# EAGLE design ArduinoInterface_v4.1 (EAGLE 9.2.1)
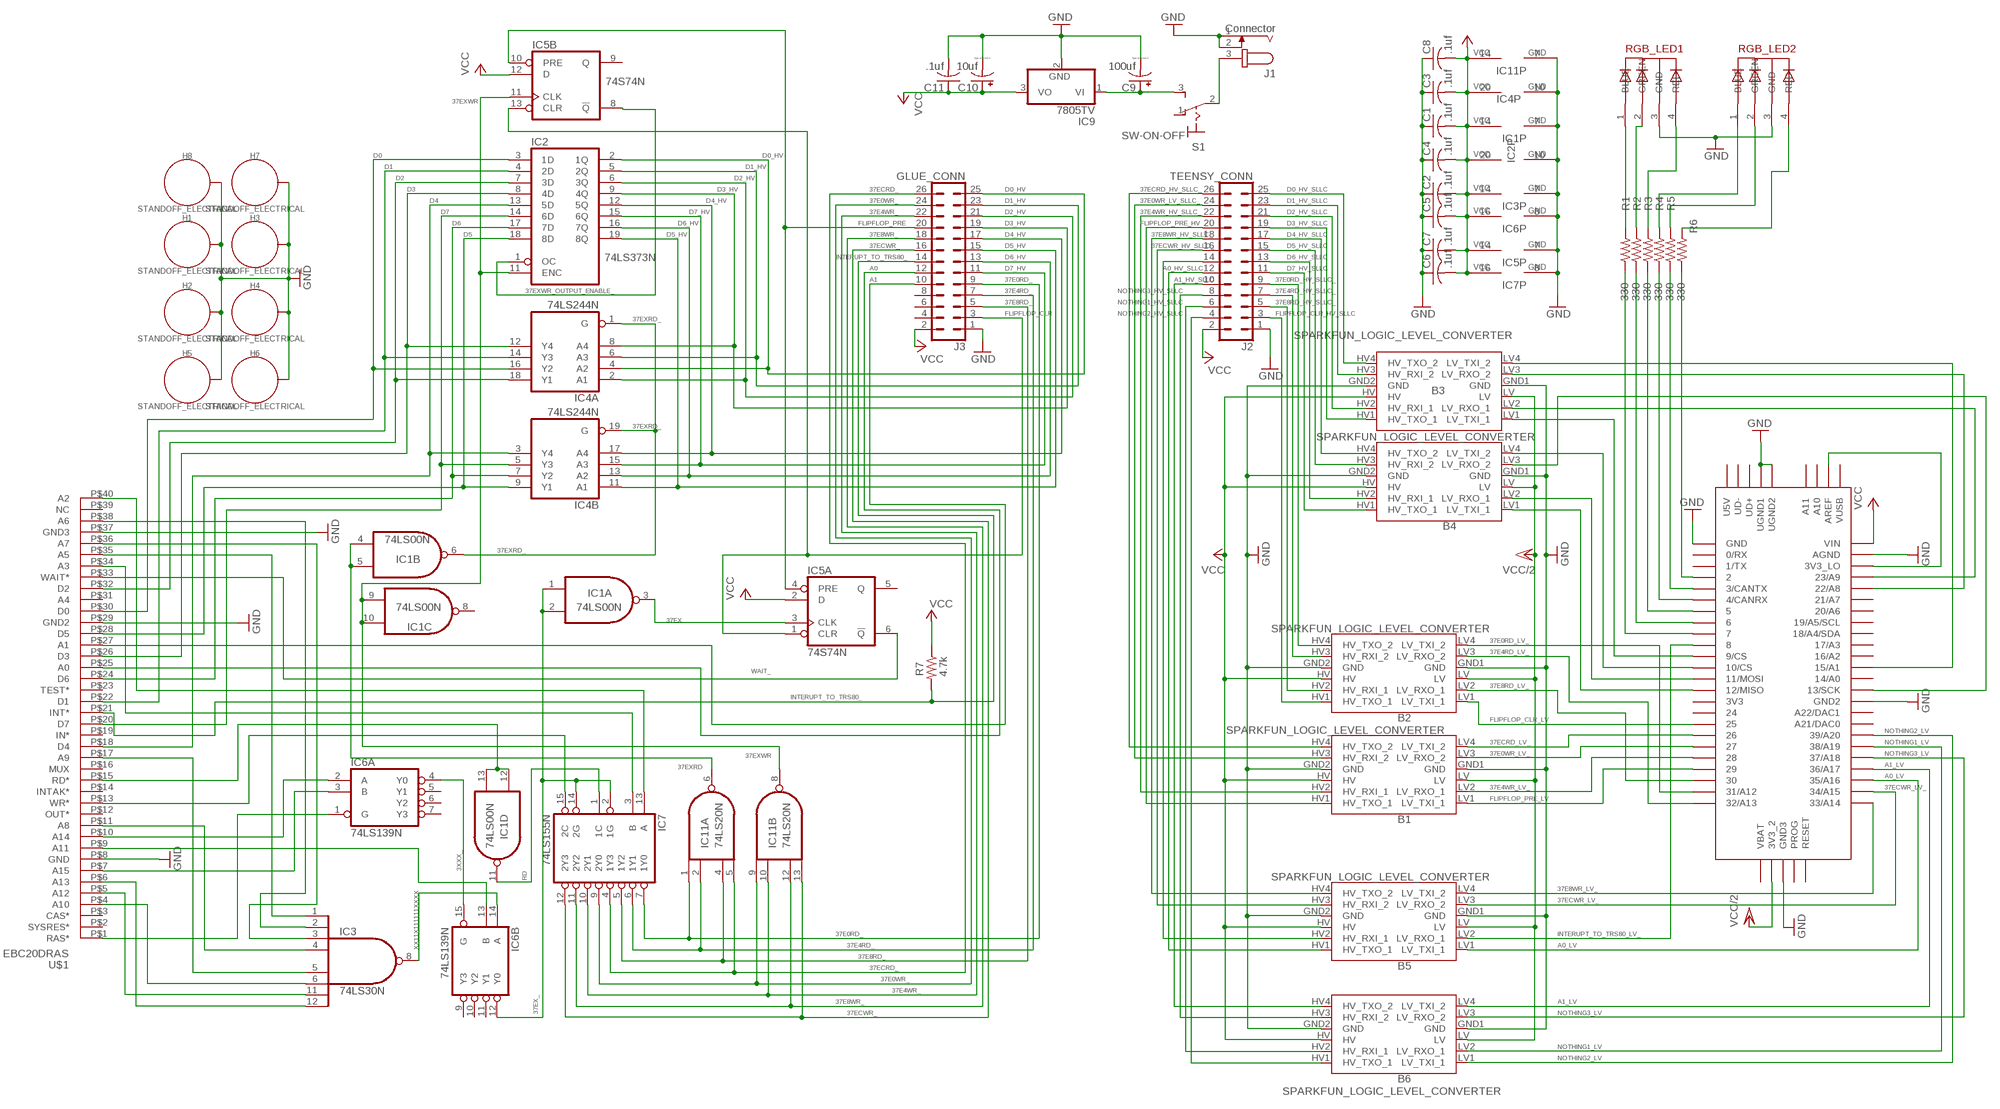
[diagram p0: schematic, sheet 1]

## Parts
B1  SPARKFUN_LOGIC_LEVEL_CONVERTER  [SPARKFUN_LOGIC_LEVEL_CONVERTER]
B2  SPARKFUN_LOGIC_LEVEL_CONVERTER  [SPARKFUN_LOGIC_LEVEL_CONVERTER]
B3  SPARKFUN_LOGIC_LEVEL_CONVERTER  [SPARKFUN_LOGIC_LEVEL_CONVERTER]
B4  SPARKFUN_LOGIC_LEVEL_CONVERTER  [SPARKFUN_LOGIC_LEVEL_CONVERTER]
B5  SPARKFUN_LOGIC_LEVEL_CONVERTER  [SPARKFUN_LOGIC_LEVEL_CONVERTER]
B6  SPARKFUN_LOGIC_LEVEL_CONVERTER  [SPARKFUN_LOGIC_LEVEL_CONVERTER]
C1  .1uf  C-US025-025X050  [C025-025X050]
C2  .1uf  C-US025-025X050  [C025-025X050]
C3  .1uf  C-US025-025X050  [C025-025X050]
C4  .1uf  C-US025-025X050  [C025-025X050]
C5  .1uf  C-US025-025X050  [C025-025X050]
C6  .1uf  C-US025-025X050  [C025-025X050]
C7  .1uf  C-US025-025X050  [C025-025X050]
C8  .1uf  C-US025-025X050  [C025-025X050]
C9  100uf  CPOL-USE5-6  [E5-6]
C10  10uf  CPOL-USE5-6  [E5-6]
C11  .1uf  C-US025-025X050  [C025-025X050]
H1  STANDOFF_ELECTRICAL  [STANDOFF-ELECTRICAL]
H2  STANDOFF_ELECTRICAL  [STANDOFF-ELECTRICAL]
H3  STANDOFF_ELECTRICAL  [STANDOFF-ELECTRICAL]
H4  STANDOFF_ELECTRICAL  [STANDOFF-ELECTRICAL]
H5  STANDOFF_ELECTRICAL  [STANDOFF-ELECTRICAL]
H6  STANDOFF_ELECTRICAL  [STANDOFF-ELECTRICAL]
H7  STANDOFF_ELECTRICAL  [STANDOFF-ELECTRICAL]
H8  STANDOFF_ELECTRICAL  [STANDOFF-ELECTRICAL]
IC1  74LS00N  [DIL14]
IC2  74LS373N  [DIL20]
IC3  74LS30N  [DIL14]
IC4  74LS244N  [DIL20]
IC5  74S74N  [DIL14]
IC6  74LS139N  [DIL16]
IC7  74LS155N  [DIL16]
IC9  7805TV  [TO220V]
IC11  74LS20N  [DIL14]
J1  Connector  JACK-PLUG0  [SPC4077]
J2  TEENSY_CONN  CONN_13X22X13  [2X13]
J3  GLUE_CONN  CONN_13X22X13  [2X13]
R1  330  R-US_0204/2V  [0204V]
R2  330  R-US_0204/2V  [0204V]
R3  330  R-US_0204/2V  [0204V]
R4  330  R-US_0204/2V  [0204V]
R5  330  R-US_0204/2V  [0204V]
R6  330  R-US_0204/2V  [0204V]
R7  4.7k  R-US_0204/2V  [0204V]
RGB_LED1  5MMRGBLED  [LED5MMRGB]
RGB_LED2  5MMRGBLED  [LED5MMRGB]
S1  SW-ON-OFF  M9040P  [M9040P]
U$1  EBC20DRAS  [EBC20DRAS]
U$2  TEENSY_3.5/3.6  [TEENSY_3.5/3.6]

## Nets
3XXX_: IC6.4(A:Y0) IC6.15(B:G)
9V: C9.+ IC9.1(VI) S1.3(S)
9V_TO_SW: J1.3 S1.2(P)
37E0RD_: IC7.7(1Y0) IC11.1(A:I0) J3.9
37E0RD_HV_SLLC_: B2.HV4(HV_TXO_2) J2.9
37E0RD_LV_: B2.LV4(LV_TXI_2) U$2.31/A12
37E0WR_: IC7.9(2Y0) IC11.9(B:I0) J3.24
37E0WR_LV_: B1.LV3(LV_RXO_2) U$2.27
37E0WR_LV_SLLC_: B1.HV3(HV_RXI_2) J2.24
37E4RD_: IC7.6(1Y1) IC11.2(A:I1) J3.7
37E4RD_HV_SLLC_: B2.HV3(HV_RXI_2) J2.7
37E4RD_LV_: B2.LV3(LV_RXO_2) U$2.32/A13
37E4WR_: IC7.10(2Y1) IC11.10(B:I1) J3.22
37E4WR_HV_SLLC_: B1.HV2(HV_RXI_1) J2.22
37E4WR_LV_: B1.LV2(LV_RXO_1) U$2.28
37E8RD_: IC7.5(1Y2) IC11.4(A:I2) J3.5
37E8RD_HV_SLLC_: B2.HV2(HV_RXI_1) J2.5
37E8RD_LV_: B2.LV2(LV_RXO_1) U$2.30
37E8WR_: IC7.11(2Y2) IC11.12(B:I2) J3.18
37E8WR_HV_SLLC_: B5.HV4(HV_TXO_2) J2.18
37E8WR_LV_: B5.LV4(LV_TXI_2) U$2.33/A14
37ECRD_: IC7.4(1Y3) IC11.5(A:I3) J3.26
37ECRD_HV_SLLC_: B1.HV4(HV_TXO_2) J2.26
37ECRD_LV_: B1.LV4(LV_TXI_2) U$2.26
37ECWR_: IC7.12(2Y3) IC11.13(B:I3) J3.16
37ECWR_HV_SLLC_: B5.HV3(HV_RXI_2) J2.16
37ECWR_LV_: B5.LV3(LV_RXO_2) U$2.34/A15
37EX: IC1.3(A:O) IC5.3(A:CLK)
37EX_: IC1.1(A:I0) IC1.2(A:I1) IC6.12(B:Y0) IC7.2(1G) IC7.14(2G)
37EXRD: IC1.4(B:I0) IC1.5(B:I1) IC11.6(A:O)
37EXRD_: IC1.6(B:O) IC4.1(A:G) IC4.19(B:G)
37EXWR: IC1.9(C:I0) IC1.10(C:I1) IC2.11(ENC) IC5.11(B:CLK) IC11.8(B:O)
37EXWR_OUTPUT_ENABLE_: IC2.1(OC) IC5.8(B:!Q)
A0: J3.12 U$1.P$25(A0)
A0_HV_SLLC: B5.HV1(HV_TXO_1) J2.12
A0_LV: B5.LV1(LV_TXI_1) U$2.35/A16
A1: J3.10 U$1.P$27(A1)
A1_HV_SLLC: B6.HV4(HV_TXO_2) J2.10
A1_LV: B6.LV4(LV_TXI_2) U$2.36/A17
A2: IC7.13(A) U$1.P$40(A2)
A3: IC7.3(B) U$1.P$34(A3)
A5: IC3.1(I0) U$1.P$35(A5)
A6: IC3.2(I1) U$1.P$38(A6)
A7: IC3.3(I2) U$1.P$36(A7)
A8: IC3.4(I3) U$1.P$11(A8)
A9: IC3.5(I4) U$1.P$17(A9)
A10: IC3.6(I5) U$1.P$4(A10)
A11: IC6.13(B:B) U$1.P$9(A11)
A12: IC3.11(I6) U$1.P$5(A12)
A13: IC3.12(I7) U$1.P$6(A13)
A14: IC6.2(A:A) U$1.P$10(A14)
A15: IC6.3(A:B) U$1.P$7(A15)
D0: IC2.3(1D) IC4.16(A:Y2) U$1.P$30(D0)
D0_HV: IC2.2(1Q) IC4.4(A:A2) J3.25
D0_HV_SLLC: B3.HV4(HV_TXO_2) J2.25
D0_LV: B3.LV4(LV_TXI_2) U$2.15/A1
D1: IC2.4(2D) IC4.14(A:Y3) U$1.P$22(D1)
D1_HV: IC2.5(2Q) IC4.6(A:A3) J3.23
D1_HV_SLLC: B3.HV3(HV_RXI_2) J2.23
D1_LV: B3.LV3(LV_RXO_2) U$2.22/A8
D2: IC2.7(3D) IC4.18(A:Y1) U$1.P$32(D2)
D2_HV: IC2.6(3Q) IC4.2(A:A1) J3.21
D2_HV_SLLC: B3.HV2(HV_RXI_1) J2.21
D2_LV: B3.LV2(LV_RXO_1) U$2.23/A9
D3: IC2.8(4D) IC4.12(A:Y4) U$1.P$26(D3)
D3_HV: IC2.9(4Q) IC4.8(A:A4) J3.19
D3_HV_SLLC: B3.HV1(HV_TXO_1) J2.19
D3_LV: B3.LV1(LV_TXI_1) U$2.9/CS
D4: IC2.13(5D) IC4.3(B:Y4) U$1.P$18(D4)
D4_HV: IC2.12(5Q) IC4.17(B:A4) J3.17
D4_HV_SLLC: B4.HV4(HV_TXO_2) J2.17
D4_LV: B4.LV4(LV_TXI_2) U$2.10/CS
D5: IC2.18(8D) IC4.9(B:Y1) U$1.P$28(D5)
D5_HV: IC2.19(8Q) IC4.11(B:A1) J3.15
D5_HV_SLLC: B4.HV3(HV_RXI_2) J2.15
D5_LV: B4.LV3(LV_RXO_2) U$2.13/SCK
D6: IC2.17(7D) IC4.7(B:Y2) U$1.P$24(D6)
D6_HV: IC2.16(7Q) IC4.13(B:A2) J3.13
D6_HV_SLLC: B4.HV2(HV_RXI_1) J2.13
D6_LV: B4.LV2(LV_RXO_1) U$2.11/MOSI
D7: IC2.14(6D) IC4.5(B:Y3) U$1.P$20(D7)
D7_HV: IC2.15(6Q) IC4.15(B:A3) J3.11
D7_HV_SLLC: B4.HV1(HV_TXO_1) J2.11
D7_LV: B4.LV1(LV_TXI_1) U$2.12/MISO
FLIPFLOP_CLR: IC5.1(A:CLR) IC5.13(B:CLR) J3.3
FLIPFLOP_CLR_HV_SLLC: B2.HV1(HV_TXO_1) J2.3
FLIPFLOP_CLR_LV: B2.LV1(LV_TXI_1) U$2.25
FLIPFLOP_PRE: IC5.4(A:PRE) IC5.10(B:PRE) J3.20
FLIPFLOP_PRE_HV: B1.HV1(HV_TXO_1) J2.20
FLIPFLOP_PRE_LV: B1.LV1(LV_TXI_1) U$2.29
GND: B1.GND1(GND) B1.GND2(GND) B2.GND1(GND) B2.GND2(GND) B3.GND1(GND) B3.GND2(GND) B4.GND1(GND) B4.GND2(GND) B5.GND1(GND) B5.GND2(GND) B6.GND1(GND) B6.GND2(GND) C1.1 C2.1 C3.1 C4.1 C5.1 C6.1 C7.1 C8.1 C9.- C10.- C11.2 H1.P1 H2.P1 H3.P1 H4.P1 H5.P1 H6.P1 H7.P1 H8.P1 IC1.7(P:GND) IC2.10(GND) IC3.7(GND) IC4.10(P:GND) IC5.7(P:GND) IC6.8(P:GND) IC7.8(GND) IC9.2(GND) IC11.7(P:GND) J1.1 J1.2 J2.1 J3.1 RGB_LED1.3(GND) RGB_LED2.3(GND) U$1.P$8(GND) U$1.P$29(GND2) U$1.P$37(GND3) U$2.AGND U$2.GND U$2.GND2 U$2.GND3 U$2.UGND1 U$2.UGND2
INTERUPT_TO_TRS80_: J3.14 R7.2 U$1.P$21(INT*)
INTERUPT_TO_TRS80_HV_SLLC_: B5.HV2(HV_RXI_1) J2.14
INTERUPT_TO_TRS80_LV_: B5.LV2(LV_RXO_1) U$2.8
N$1: U$2.3V3_LO U$2.AREF
N$2: R2.2 RGB_LED1.2(GREEN)
N$3: R6.1 U$2.2
N$4: R5.1 U$2.3/CANTX
N$5: R4.1 U$2.4/CANRX
N$6: R3.1 U$2.5
N$7: R2.1 U$2.6
N$8: R1.1 U$2.7
N$10: R1.2 RGB_LED1.1(BLUE)
N$15: R3.2 RGB_LED1.4(RED)
N$19: R4.2 RGB_LED2.1(BLUE)
N$20: R5.2 RGB_LED2.2(GREEN)
N$21: R6.2 RGB_LED2.4(RED)
NOTHING1_HV_SLLC: B6.HV2(HV_RXI_1) J2.6
NOTHING1_LV: B6.LV2(LV_RXO_1) U$2.38/A19
NOTHING2_HV_SLLC: B6.HV1(HV_TXO_1) J2.4
NOTHING2_LV: B6.LV1(LV_TXI_1) U$2.39/A20
NOTHING3_HV_SLLC: B6.HV3(HV_RXI_2) J2.8
NOTHING3_LV: B6.LV3(LV_RXO_2) U$2.37/A18
RAS_: IC6.1(A:G) U$1.P$1(RAS*)
RD: IC1.11(D:O) IC7.1(1C)
RD_: IC1.12(D:I0) IC1.13(D:I1) U$1.P$15(RD*)
VCC: B1.HV B2.HV B3.HV B4.HV B5.HV B6.HV C1.2 C2.2 C3.2 C4.2 C5.2 C6.2 C7.2 C8.2 C10.+ C11.1 IC1.14(P:VCC) IC2.20(VCC) IC3.14(VCC) IC4.20(P:VCC) IC5.2(A:D) IC5.12(B:D) IC5.14(P:VCC) IC6.16(P:VCC) IC7.16(VCC) IC9.3(VO) IC11.14(P:VCC) J2.2 J3.2 R7.1 U$2.VIN
VCC/2: B1.LV B2.LV B3.LV B4.LV B5.LV B6.LV U$2.3V3_2
WAIT_: IC5.6(A:!Q) U$1.P$33(WAIT*)
WR_: IC7.15(2C) U$1.P$13(WR*)
XX11X111111XXXX: IC3.8(O) IC6.14(B:A)
Unconnected: IC1.8(C:O) IC5.5(A:Q) IC5.9(B:Q) IC6.5(A:Y1) IC6.6(A:Y2) IC6.7(A:Y3) IC6.9(B:Y3) IC6.10(B:Y2) IC6.11(B:Y1) J3.4 J3.6 J3.8 S1.1(O) U$1.P$2(SYSRES*) U$1.P$3(CAS*) U$1.P$12(OUT*) U$1.P$14(INTAK*) U$1.P$16(MUX) U$1.P$19(IN*) U$1.P$23(TEST*) U$1.P$31(A4) U$1.P$39(NC) U$2.0/RX U$2.1/TX U$2.3V3 U$2.14/A0 U$2.16/A2 U$2.17/A3 U$2.18/A4/SDA U$2.19/A5/SCL U$2.20/A6 U$2.21/A7 U$2.21/DAC0(A21/DAC0) U$2.24 U$2.A10 U$2.A11 U$2.A22/DAC1 U$2.PROG U$2.RESET U$2.U5V U$2.UD+ U$2.UD- U$2.VBAT U$2.VUSB

## Library data of the parts
B1-B6 = SparkFun-Boards:SPARKFUN_LOGIC_LEVEL_CONVERTER: SparkFun Logic Level Converter -Bi-Directional This is the mechnical outline for the 3.3V - 5V bi directional logic level converter. *Note, the "LOCK" Package has the header pins staggered by an offset of 5 mils (off center line), so that when you slide a row of standard 0.1" headers into the PTH pads, it will hold position vertically. See the follwing turorial for more information on this type of special footprints: Sneaky Footprints <https://www.sparkfun.com/tutorials/114> SparkFun Products: SparkFun Logic Level Converter - Bi-Directional <https://www.sparkfun.com/products/12009>
C1-C8 C11 = adafruit:C-US: CAPACITOR, American symbol
C9 C10 = resistor:CPOL-US: POLARIZED CAPACITOR, American symbol
H1-H8 = SparkFun-Hardware:STANDOFF_ELECTRICAL: Stand Off Drill holes with an electrical connection. For example, use these to ground your board to a chassis. Example SparkFun Products Screw - Phillips Head (1/4", 4-40, 10 pack) <https://www.sparkfun.com/products/10453> (PRT-10453) Screw - Phillips Head (1/2", 4-40, 10 pack) <https://www.sparkfun.com/products/10452> (PRT-10452) Screw - Phillips Head (3/4", 4-40, 10 pack) <https://www.sparkfun.com/products/10451> (PRT-10451) Screw - Phillips Head (1", 4-40, 10 pack) <https://www.sparkfun.com/products/10450> (PRT-10450)
IC1 = 74xx-us:74*00: Quad 2-input NAND gate
IC2 = 74xx-us:74*373: Octal D type transparent LATCH, edge triggered
IC3 = 74xx-us:74*30: 8-input NAND gate
IC4 = 74xx-us:74*244: Octal BUFFER and LINE DRIVER, 3-state
IC5 = 74xx-us:74*74: Dual D type positive edge triggered FLIP FLOP, preset and clear
IC6 = 74xx-us:74*139: Dual 2-line to 4-line DECODER/DEMULTIPLEXER
IC7 = 74xx-us:74*155: Dual 2-line to 4-line data DECODER/DEMULTIPLEXER
IC9 = linear:78*: Positive VOLTAGE REGULATOR Source: http://cache.national.com/ds/LM/LM78L05.pdf http://www.fairchildsemi.com/ds/LM/LM7805.pdf
IC11 = 74xx-us:74*20: Dual 4-input NAND gate
J1 = con-jack:JACK-PLUG: DC POWER JACK Power Jack, DC, Right Angle, Through Hole, Rated 5A at 16VDC, PC Terminals Distributor: Farnell (www.Farnell.de) Drawing: 84N1161.pdf / 84N1162.pdf Manufacturer: SPC Technology (www.spctechnology.com) Type: SPC4077 / SPC 4078; OC_FARNELL: unknown; OC_NEWARK: unknown
J2 J3 = SparkFun-Connectors:CONN_13X2: Multi connection point. Often used as Generic Header-pin footprint for 0.1 inch spaced/style header connections On any of the 0.1 inch spaced packages, you can populate with these: Break Away Headers - Straight <https://www.sparkfun.com/products/116> (PRT-00116) Break Away Male Headers - Right Angle <https://www.sparkfun.com/products/553> (PRT-00553) Female Headers <https://www.sparkfun.com/products/115> (PRT-00115) Break Away Headers - Machine Pin <https://www.sparkfun.com/products/117> (PRT-00117) Break Away Female Headers - Swiss Machine Pin <https://www.sparkfun.com/products/743> (PRT-00743)
R1-R7 = resistor:R-US_: RESISTOR, American symbol
RGB_LED1 RGB_LED2 = adafruit:5MMRGBLED
S1 = switch:M9040P: TOGGLE SWITCH Marquardt
U$1 = TMS99:EBC20DRAS
U$2 = Teensy356:TEENSY_3.5/3.6

## Net classes
0 default: width 0.3 mm, clearance 0.05 mm

## Board
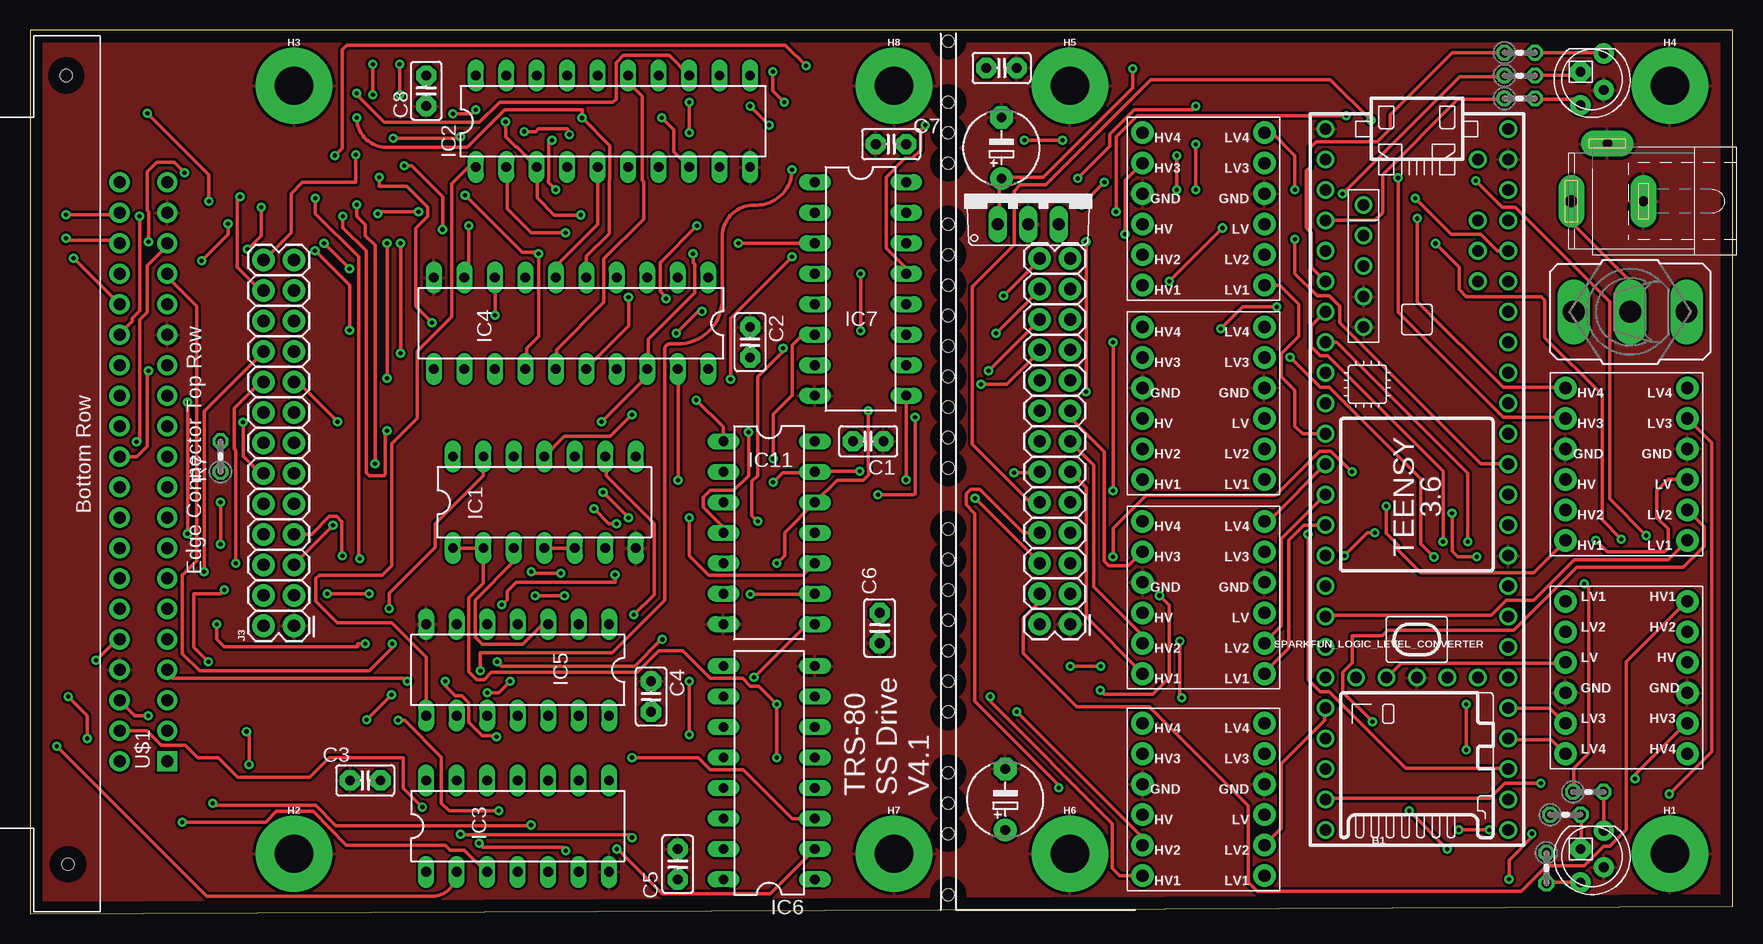
[diagram p1: board, top side]
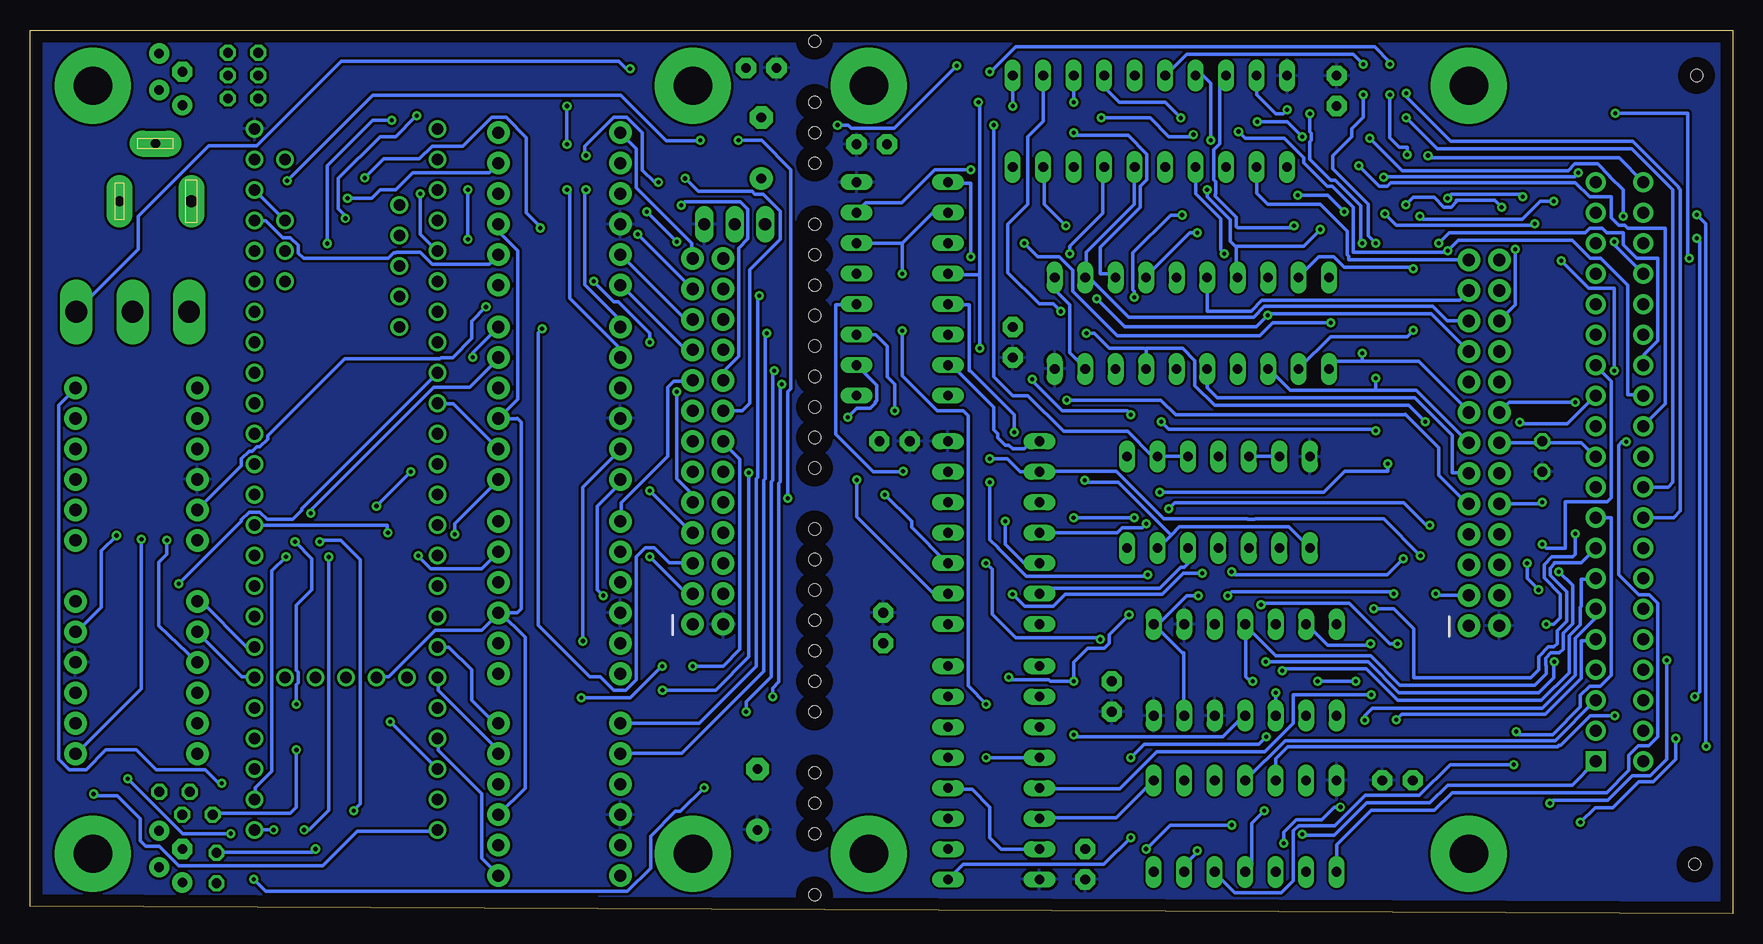
[diagram p2: board, bottom side, seen from below]

Size 141.9 x 73.65 mm. Coordinates in mm from the lower left corner, seen from the top.
Outline: 0,0 141.9,0.64 141.9,73.65 0,73.65 0,0
Copper layers (1*16): Top 0.035mm / dielectric 1.5mm / Bottom 0.035mm
Design rules "default": minimum track width 0.2mm, minimum drill 0.35mm, track to track 8mil, track to pad 8mil, pad to pad 8mil, via to via 8mil, smd to smd 8mil, copper to edge 40mil, drill to drill 6mil, minimum pad ring 10mil, minimum via ring 8mil, stop-mask expansion 4mil, vias tented up to drill 0mil, thermal gap 10mil
Holes 1 mm at 76.52,72.71 76.52,67.63 76.52,62.55 76.52,57.47 76.52,52.39 76.52,49.85 76.52,47.31 76.52,42.23 76.52,39.69 76.52,32.07 76.52,29.53 76.52,26.99 76.52,21.91 76.52,19.37 76.52,16.83 76.52,11.75 76.52,6.67 76.52,1.59 76.52,44.77 76.52,54.93 76.52,37.15 76.52,9.21 76.52,65.09 76.52,24.45

### Footprints (pad centres in the part's own frame; a part is rotated, then mirrored left to right if it is on the bottom)
SPARKFUN_LOGIC_LEVEL_CONVERTER = drill 1.016 pad 1.88: GND1 -5.08,-1.27; GND2 5.08,-1.27; HV 5.08,1.27; HV1 5.08,6.35; HV2 5.08,3.81; HV3 5.08,-3.81; HV4 5.08,-6.35; LV -5.08,1.27; LV1 -5.08,6.35; LV2 -5.08,3.81; LV3 -5.08,-3.81; LV4 -5.08,-6.35
C025-025X050 = drill 0.813 pad 1.676 octagon: 1 -1.27,0; 2 1.27,0
E5-6 = drill 0.813 pad 1.905: + -2.54,0 | drill 0.813 pad 1.905 octagon: - 2.54,0
STANDOFF-ELECTRICAL = drill 3.2 pad 6.35: P1 0,0
DIL14 = drill 0.813 long: 1 -7.62,-3.81; 2 -5.08,-3.81; 3 -2.54,-3.81; 4 0,-3.81; 5 2.54,-3.81; 6 5.08,-3.81; 7 7.62,-3.81; 8 7.62,3.81; 9 5.08,3.81; 10 2.54,3.81; 11 0,3.81; 12 -2.54,3.81; 13 -5.08,3.81; 14 -7.62,3.81
DIL20 = drill 0.813 long: 1 -11.43,-3.81; 2 -8.89,-3.81; 3 -6.35,-3.81; 4 -3.81,-3.81; 5 -1.27,-3.81; 6 1.27,-3.81; 7 3.81,-3.81; 8 6.35,-3.81; 9 8.89,-3.81; 10 11.43,-3.81; 11 11.43,3.81; 12 8.89,3.81; 13 6.35,3.81; 14 3.81,3.81; 15 1.27,3.81; 16 -1.27,3.81; 17 -3.81,3.81; 18 -6.35,3.81; 19 -8.89,3.81; 20 -11.43,3.81
DIL16 = drill 0.813 long: 1 -8.89,-3.81; 2 -6.35,-3.81; 3 -3.81,-3.81; 4 -1.27,-3.81; 5 1.27,-3.81; 6 3.81,-3.81; 7 6.35,-3.81; 8 8.89,-3.81; 9 8.89,3.81; 10 6.35,3.81; 11 3.81,3.81; 12 1.27,3.81; 13 -1.27,3.81; 14 -3.81,3.81; 15 -6.35,3.81; 16 -8.89,3.81
TO220V = drill 1.016 long: 1 -2.54,-2.54; 2 0,-2.54; 3 2.54,-2.54
SPC4077 = drill 0.8 pad 2.184 long: 1 -3,0; 2 0,-4.8 | drill 1 pad 2.184 long: 3 3,0
2X13 = drill 1.016 pad 1.88: 1 0,0; 2 0,2.54; 3 2.54,0; 4 2.54,2.54; 5 5.08,0; 6 5.08,2.54; 7 7.62,0; 8 7.62,2.54; 9 10.16,0; 10 10.16,2.54; 11 12.7,0; 12 12.7,2.54; 13 15.24,0; 14 15.24,2.54; 15 17.78,0; 16 17.78,2.54; 17 20.32,0; 18 20.32,2.54; 19 22.86,0; 20 22.86,2.54; 21 25.4,0; 22 25.4,2.54; 23 27.94,0; 24 27.94,2.54; 25 30.48,0; 26 30.48,2.54
0204V = drill 0.813 octagon: 1 -1.27,0; 2 1.27,0
LED5MMRGB = drill 0.8 pad 1.676: 1 -2.159,0.968; 3 0.889,0.968; 4 2.159,-0.968 | drill 0.8 pad 1.676 octagon: 2 -0.635,-0.968
M9040P = drill 1.803 long: 1 0,4.699; 2 0,0; 3 0,-4.699
EBC20DRAS = drill 1 pad 1.676 square: P$1 0,0 | drill 1 pad 1.676: P$2 0,3.969; P$3 2.54,0; P$4 2.54,3.969; P$5 5.08,0; P$6 5.08,3.969; P$7 7.62,0; P$8 7.62,3.969; P$9 10.16,0; P$10 10.16,3.969; P$11 12.7,0; P$12 12.7,3.969; P$13 15.24,0; P$14 15.24,3.969; P$15 17.78,0; P$16 17.78,3.969; P$17 20.32,0; P$18 20.32,3.969; P$19 22.86,0; P$20 22.86,3.969; P$21 25.4,0; P$22 25.4,3.969; P$23 27.94,0; P$24 27.94,3.969; P$25 30.48,0; P$26 30.48,3.969; P$27 33.02,0; P$28 33.02,3.969; P$29 35.56,0; P$30 35.56,3.969; P$31 38.1,0; P$32 38.1,3.969; P$33 40.64,0; P$34 40.64,3.969; P$35 43.18,0; P$36 43.18,3.969; P$37 45.72,0; P$38 45.72,3.969; P$39 48.26,0; P$40 48.26,3.969 | hole 1: -8.572,8.255; 57.15,8.414
TEENSY_3.5/3.6 = drill 0.965: 0/RX -25.4,-7.62; 1/TX -22.86,-7.62; 2 -20.32,-7.62; 3/CANTX -17.78,-7.62; 3V3 7.62,-7.62; 3V3_2 17.78,-2.54; 3V3_LO -22.86,7.62; 4/CANRX -15.24,-7.62; 5 -12.7,-7.62; 6 -10.16,-7.62; 7 -7.62,-7.62; 8 -5.08,-7.62; 9/CS -2.54,-7.62; 10/CS 0,-7.62; 11/MOSI 2.54,-7.62; 12/MISO 5.08,-7.62; 13/SCK 5.08,7.62; 14/A0 2.54,7.62; 15/A1 0,7.62; 16/A2 -2.54,7.62; 17/A3 -5.08,7.62; 18/A4/SDA -7.62,7.62; 19/A5/SCL -10.16,7.62; 20/A6 -12.7,7.62; 21/A7 -15.24,7.62; 21/DAC0 12.7,7.62; 22/A8 -17.78,7.62; 23/A9 -20.32,7.62; 24 10.16,-7.62; 25 12.7,-7.62; 26 15.24,-7.62; 27 17.78,-7.62; 28 20.32,-7.62; 29 22.86,-7.62; 30 25.4,-7.62; 31/A12 27.94,-7.62; 32/A13 30.48,-7.62; 33/A14 30.48,7.62; 34/A15 27.94,7.62; 35/A16 25.4,7.62; 36/A17 22.86,7.62; 37/A18 20.32,7.62; 38/A19 17.78,7.62; 39/A20 15.24,7.62; A10 -17.78,5.08; A11 -15.24,5.08; A22/DAC1 10.16,7.62; AGND -25.4,7.62; AREF -20.32,5.08; GND -27.94,-7.62; GND2 7.62,7.62; GND3 17.78,0; PROG 17.78,2.54; RESET 17.78,5.08; U5V -21.59,-4.445; UD+ -16.51,-4.445; UD- -19.05,-4.445; UGND1 -13.97,-4.445; UGND2 -11.43,-4.445; VBAT 17.78,-5.08; VIN -27.94,7.62; VUSB -25.4,5.08

### Placement (x,y rotation side)
B1  97.79,9.53 180 top
B2  133.03,37.47 180 top
B3  97.79,58.74 180 top
B4  97.79,26.35 180 top
B5  97.79,42.55 180 top
B6  133.03,19.68 0 top
C1  69.85,39.37 180 top
C2  60.01,47.62 270 top
C3  27.94,11.11 0 top
C4  51.75,18.1 270 top
C5  53.98,4.13 270 top
C6  70.8,23.81 90 top
C7  71.75,64.14 0 top
C8  33.02,68.58 90 top
C9  80.96,63.82 90 top
C10  81.28,9.53 90 top
C11  80.96,70.48 0 top
H1  136.66,5 0 top
H2  22,5 0 top
H3  22,69 0 top
H4  136.66,69 0 top
H5  86.67,69 0 top
H6  86.67,5 0 top
H7  72,5 0 top
H8  72,69 0 top
IC1  42.86,34.29 0 top
IC2  48.58,66.04 0 top
IC3  40.64,7.3 0 top
IC4  45.09,49.21 180 top
IC5  40.64,20.32 180 top
IC6  61.59,11.75 90 top
IC7  69.22,52.07 270 top
IC9  83.19,60.01 0 top
IC11  61.59,31.75 270 top
J1  131.44,59.37 180 top
J2  86.68,24.13 90 top
J3  22,24 90 top
R1  129.86,10.16 0 top
R2  127.95,8.26 0 top
R3  126.36,3.81 270 top
R4  124.14,71.75 0 top
R5  124.14,69.85 0 top
R6  124.14,67.94 0 top
R7  15.88,38.1 90 top
RGB_LED1  130.18,4.76 270 top
RGB_LED2  130.18,69.53 270 top
S1  133.35,50.16 90 top
U$1  11.43,12.7 90 top
U$2  115.57,37.47 270 top

### Tracks (layer width: path | path; a pad name or v marks a point on that pad's centre or on a via)
3XXX_
  Bottom 0.3: IC6.4 65.38,10.38 63.4,10.38 61.91,8.89 61.91,6.35 60.96,5.4 IC6.15
9V  (via drill 0.35)
  Top 0.3: IC9.1 80.75,57.5 80.75,61.12 80.88,61.25 C9.+ 81,61.38 84.44,61.38 91.89,68.83 v91.89,70.42
  Bottom 0.3: v91.89,70.42 92.21,70.42 92.85,71.05 115.95,71.05 123,64 127,64 132.88,58.12 132.88,55.38 138,50.25 S1.3
9V_TO_SW
  Top 0.3: S1.2 133.35,52.69 128.5,57.54 128.5,59.25 J1.3
37E0RD_  (via drill 0.35)
  Top 0.3: IC11.1 57.75,39.38 57.75,40.57 v55.51,42.81
  Bottom 0.3: v55.51,42.81 47.65,42.81 46.44,41.59 27.3,41.59 27.28,41.62 24.51,38.85 24.51,36.54 22.13,34.16 J3.9 | IC11.1 58.42,39.37 59.05,38.73 60.01,38.73 60.33,39.05 60.64,39.05 61.28,39.69 61.28,40.01 61.59,40.32 61.59,42.23 65.09,45.72 IC7.7
37E0RD_HV_SLLC_  (via drill 0.35)
  Top 0.3: v88,56 v88,43.5 | v90.5,58.5 90.5,64.75 92.25,66.5 v109.68,66.5 | B2.HV4 127.88,43.88 122.75,43.88 115.61,51.01 v115.61,57.94
  Bottom 0.3: v88,43.5 88,36.25 86.75,35 86.75,34.38 J2.9 | v90.5,58.5 v88,56 | v115.61,57.94 115.61,58.15 116.2,58.74 116.2,61.28 112.71,64.77 111.44,64.77 109.86,66.36 109.86,66.5 v109.68,66.5
37E0RD_LV_  (via drill 0.35)
  Top 0.3: v125.91,10.88 122.88,10.88 121.62,9.62 108,9.62 U$2.31/A12
  Bottom 0.3: v125.91,10.88 126.16,10.88 127.29,12 131.38,12 133.03,13.65 135.57,13.65 137.22,12 138.62,12 139.5,12.88 139.5,42.38 138.12,43.75 B2.LV4
37E0WR_  (via drill 0.35)
  Top 0.3: v73,36.15 73,43.12 IC7.9 | v17.5,59.75 17.25,59.5 17.25,53.88 18.75,52.38 18.75,52 19.38,52 J3.24 | v41.77,28.5 41.9,28.38 v44.22,28.38 | v60.03,26.62 65.38,26.62 IC11.9 | v27.47,29.59 27.38,29.68 27.38,54.75 23.77,58.35 v23.77,59.62
  Bottom 0.3: v73,36.15 73,33.07 66.6,26.67 IC11.9 | v23.77,59.62 23.45,59.94 17.69,59.94 v17.5,59.75 | v44.22,28.38 45.81,28.38 47.56,26.62 55.62,26.62 56.62,25.62 59.03,25.62 v60.03,26.62 | v41.77,28.5 41.53,28.26 28.8,28.26 v27.47,29.59
37E0WR_LV_
  Bottom 0.3: U$2.27 107.88,19.62 107.88,18.62 102.88,13.62 102.88,13.38 B1.LV3
37E0WR_LV_SLLC_  (via drill 0.35)
  Top 0.3: v80.5,48.38 84.12,52 J2.24
  Bottom 0.3: v80.5,48.38 80.62,48.25 80.62,36.25 80.75,36.12 80.75,20.2 87.58,13.38 92.62,13.38 B1.HV3
37E4RD_  (via drill 0.35)
  Top 0.3: v61.92,37.93 61.92,41.62 63.5,43.2 63.5,47.38 64.25,48.12 64.25,48.25 65.38,48.25 IC7.6 | J3.7 23.46,31.62 24.95,33.11 25.55,33.11 25.98,32.68 25.98,29.9 v26.04,29.84
  Bottom 0.3: v61.92,37.93 60.47,37.93 59.37,36.83 IC11.2 57.75,36.88 51.38,36.88 47.41,32.91 40.45,32.91 40.43,32.89 39.82,32.89 39.8,32.91 29.1,32.91 v26.04,29.84
37E4RD_HV_SLLC_  (via drill 0.35)
  Top 0.3: v90.25,47.62 v90.25,35.25 | v114,61.32 114,50.12 122.75,41.38 127.88,41.38 B2.HV3 | v99.38,57.15 v94.93,52.7
  Bottom 0.3: v90.25,35.25 86.75,31.75 J2.7 | v90.25,47.62 90.25,48.38 92.88,51 93.25,51 94.93,52.68 v94.93,52.7 | v99.38,57.15 99.38,57.25 100.55,58.42 100.55,64.67 102.23,66.36 102.31,66.36 102.33,66.38 103.41,66.38 105.83,63.95 108.4,63.95 109.45,62.91 112.41,62.91 v114,61.32
37E4RD_LV_  (via drill 0.35)
  Top 0.3: v136.6,9.98 140.12,13.5 140.12,39.25 138.12,41.25 B2.LV3
  Bottom 0.3: U$2.32/A13 108,6.88 114.65,6.88 117.53,4 129.5,4 131.12,5.62 132.25,5.62 132.72,6.09 132.72,7.94 134.62,9.84 136.47,9.84 v136.6,9.98
37E4WR_  (via drill 0.35)
  Top 0.3: v19.27,58.88 19.27,56.52 v18.12,55.38 | v28.75,37.51 28.75,55.7 27.94,56.52 27.94,57.42 27.24,58.12 v27.24,59.08 | v49.88,33 v47.75,35.12 | v54.94,33 54.94,29.82 56.57,28.2 64.39,28.2 IC11.10 | v70.66,34.91 70.67,34.92 73.66,34.92 73.75,35.02 v73.75,41.38
  Bottom 0.3: v70.66,34.91 68.44,32.69 68.44,32.19 65.5,29.25 IC11.10 | v73.75,41.38 73,42.12 71.88,42.12 71.45,42.55 71.45,42.66 71.35,42.76 71.35,44.05 IC7.10 | v18.12,55.38 18.12,50.75 19.38,49.5 J3.22 | v28.75,37.51 28.75,36.88 32.34,36.88 34.09,35.12 v47.75,35.12 | v54.94,33 v49.88,33 | v27.24,59.08 26.63,59.69 24.87,59.69 24.07,58.89 23.47,58.89 23.04,59.32 23.04,59.44 19.83,59.44 v19.27,58.88
37E4WR_HV_SLLC_  (via drill 0.35)
  Top 0.3: v79.88,45.25 84.12,49.5 J2.22 | v82.23,16.83 92.71,6.35 B1.HV2
  Bottom 0.3: v79.88,45.25 80,45.12 80,36.12 80.12,36 80.12,19.76 82.23,17.65 v82.23,16.83
37E4WR_LV_
  Top 0.3: U$2.28 107.88,17.12 107.88,16.12 104.25,12.5 104.25,7.12 102.88,5.75 B1.LV2
37E8RD_  (via drill 0.35)
  Top 0.3: v59.88,40.12 59.88,36.51 58.67,35.3 56.7,35.3 56.11,34.71 56.11,33.87 57.78,32.2 IC11.4 | v25.25,32.38 22,29.12 J3.5 | v48.88,32.5 48.24,32.5 v47,33.74
  Bottom 0.3: IC7.5 65.38,50.75 63.62,50.75 63.62,45.25 63.54,45.25 59.88,41.59 v59.88,40.12 | v25.25,32.38 25.57,32.38 27.44,34.25 46.49,34.25 v47,33.74 | IC11.4 51.31,31.75 50.9,32.15 49.22,32.15 v48.88,32.5
37E8RD_HV_SLLC_  (via drill 0.35)
  Top 0.3: v99.23,48.75 101.05,50.57 v103.91,50.57
  Bottom 0.3: v99.23,48.75 99.55,48.43 99.55,24.05 95.25,19.75 94.38,19.75 93.25,18.62 92.25,18.62 91.38,19.5 91.38,29.75 90.62,30.5 89.88,30.5 88.62,29.25 86.75,29.25 J2.5 | B2.HV2 127.88,33.75 124.28,37.34 124.28,37.92 123.64,38.55 123.37,38.55 123.01,38.91 122.74,38.91 122.1,39.55 122.1,39.83 115.67,46.25 107.75,46.25 107.64,46.35 106.68,46.35 105.09,47.94 105.09,49.38 v103.91,50.57
37E8RD_LV_  (via drill 0.35)
  Top 0.3: B2.LV2 138.12,33.62 139.5,32.25 139.5,30.62 137.75,28.88 128.88,28.88 123.62,23.62 113.15,23.62 112.7,23.18 110.17,23.18 110.17,20.91 109.4,20.14 109.4,18.48 v111.88,16
  Bottom 0.3: v111.88,16 108,12.12 U$2.30
37E8WR_  (via drill 0.35)
  Top 0.3: J3.18 19.38,44.25 18.75,44.25 18.75,43.88 17,42.12 17,38.75 17.12,38.62 17.12,37.62 17.14,37.6 v17.14,29.21 | v14.87,21 v14.87,21.01 13.65,22.23 13.65,26.67 15.88,26.67 v16.19,26.99 | v52.7,22.86 52.61,22.86 50.39,20.64 39.28,20.64 v38.92,21 | v62.24,29.2 62.88,29.84 62.88,31.76 IC11.12 67.26,36.14 69.45,36.14 69.88,36.57 69.88,37.18 69.85,37.2 v69.85,41.91
  Bottom 0.3: v14.87,21 14.92,20.95 14.92,19.68 16.19,18.41 27.83,18.41 30.4,20.98 38.9,20.98 v38.92,21 | v52.7,22.86 52.75,22.91 52.75,23 59.75,23 61.73,24.98 61.73,28.69 v62.24,29.2 | IC7.11 71.44,48.26 70.48,47.31 70.48,44.77 69.85,44.13 v69.85,41.91 | v16.19,26.99 17.14,27.94 v17.14,29.21
37E8WR_HV_SLLC_  (via drill 0.35)
  Top 0.3: v95.57,63.18 v95.57,60.33 | v87.63,59.05 v89.53,60.96
  Bottom 0.3: B5.HV4 92.71,49.45 95.66,52.4 95.66,60.23 v95.57,60.33 | J2.18 84.14,45.16 82.84,46.45 82.84,55.47 82.07,56.24 82.07,58.69 82.72,59.34 87.34,59.34 v87.63,59.05 | v95.57,63.18 95.66,63.28 95.66,63.96 93.25,66.38 92.17,66.38 90.87,65.08 90.87,61.98 89.85,60.96 v89.53,60.96
37E8WR_LV_  (via drill 0.35)
  Top 0.3: v105,46.38 107.5,43.88 108.25,43.88 115.89,36.24 115.89,30.8 115.93,30.8 v117,29.73 | v119.06,6.99 v121.6,6.99
  Bottom 0.3: v117,29.73 117,8.61 118.63,6.99 v119.06,6.99 | v105,46.38 105,46.75 102.88,48.88 B5.LV4 | U$2.33/A14 v121.6,6.99
37ECRD_  (via drill 0.35)
  Top 0.3: v62.75,47.12 62.75,46.88 60.62,44.75 60.62,36.49 60.17,36.04 60.17,33.18 v60.64,32.7 | J3.26 19.5,54.5 21.75,56.75 21.75,60.01 22.7,60.96 27.15,60.96 v27.15,63.25 | v28.57,70.8 v28.57,68.26 | v61.91,70.17 61.91,68.58 v62.87,67.63
  Bottom 0.3: 62.75,53.25 v62.75,47.12 | 62.75,53.25 65.38,53.25 IC7.4 | 62.75,53.25 62.75,67.63 v62.87,67.63 | v28.57,70.8 28.57,70.98 29.84,72.25 59.75,72.25 61.83,70.17 v61.91,70.17 | v28.57,68.26 28.57,64.66 27.79,63.88 27.15,63.88 v27.15,63.25 | IC11.5 59.05,29.21 60.64,30.8 v60.64,32.7
37ECRD_HV_SLLC_  (via drill 0.35)
  Top 0.3: v81.12,51.5 84.12,54.5 J2.26
  Bottom 0.3: B1.HV4 86.14,15.88 81.38,20.64 81.38,36.25 81.25,36.38 81.25,51.38 v81.12,51.5
37ECRD_LV_
  Bottom 0.3: U$2.26 107,22.23 105.09,20.32 105.09,17.78 103.19,15.88 B1.LV4
37ECWR_  (via drill 0.35)
  Top 0.3: v69.14,36.88 65.5,36.88 IC11.13 65.38,36.75 62.72,36.75 v61.92,35.95 | v13.12,31.68 v13.12,42.62 | v27.95,22.5 27.31,22.5 27.31,22.25 16.17,22.25 15.56,22.86 v15.56,24.13 | v39.32,25.75 39.75,26.18 39.75,26.88 40.5,27.62 48.75,27.62 v48.75,28.25
  Bottom 0.3: v69.14,36.88 69.17,36.85 71.62,36.85 74.75,39.98 74.75,50.75 73.12,50.75 IC7.12 | v13.12,42.62 18.62,42.62 19.38,41.88 J3.16 | v27.95,22.5 28.58,22.5 31.95,25.88 39.19,25.88 v39.32,25.75 | v48.75,28.25 48.88,28.12 58.88,28.12 61.23,30.48 61.23,30.49 61.92,31.19 v61.92,35.95 | v13.12,31.68 13.12,29.96 13.34,29.75 15.08,29.75 15.73,29.1 15.73,27.99 14.36,26.62 14.36,24.69 14.92,24.13 v15.56,24.13
37ECWR_HV_SLLC_  (via drill 0.35)
  Top 0.3: v97.16,67.31 96.85,67 92.04,67 90,64.96 90,63.96 v87.31,61.28 | v97.16,60.33 v97.16,64.14
  Bottom 0.3: J2.16 82.55,41.91 81.92,42.55 81.92,53.66 79.38,56.2 79.38,58.54 80.81,59.97 81.5,59.97 81.73,60.2 86.23,60.2 v87.31,61.28 | B5.HV3 92.71,47.07 96.93,51.29 96.93,60.1 v97.16,60.33 | v97.16,67.31 v97.16,64.14
37ECWR_LV_  (via drill 0.35)
  Top 0.3: v120.57,29.75 118.98,29.75 118.5,30.23 v118.5,33.38
  Bottom 0.3: v120.57,29.75 121.75,28.57 121.75,11.88 123.12,10.5 123.12,9.62 U$2.34/A15 | v118.5,33.38 118.5,33.62 108.25,43.88 105.25,43.88 102.88,46.25 B5.LV3
37EX
  Top 0.3: IC1.3 40.32,29.36 37.09,26.12 37.09,23.05 37.68,22.46 41.06,22.46 42.73,24.13 IC5.3
37EX_  (via drill 0.35)
  Top 0.3: v69.22,53.34 v69.22,48.58 | v62.23,13.02 v62.23,17.46 60.71,18.98 60.03,18.98 59.39,19.62 56.7,19.62 54.4,21.93 52.39,21.93 50.6,20.13 38.46,20.13 37.84,19.52 37.23,19.52 36.58,20.17 36.58,26.33 37.78,27.53 IC1.2 IC1.1
  Bottom 0.3: IC7.14 73,55.88 69.22,55.88 | v69.22,48.58 69.22,44.84 66.28,41.91 64.14,41.91 63.73,41.51 63.73,18.98 62.23,17.48 v62.23,17.46 | 69.22,55.88 v69.22,53.34 | IC6.12 v62.23,13.02 | IC7.2 66.67,58.42 69.22,55.88
37EXRD
  Top 0.3: IC1.4 IC1.5
  Bottom 0.3: 57.75,26.75 IC11.6 57.33,27.13 47.77,27.13 46.02,28.88 45.73,28.88 45.4,29.21 IC1.5
37EXRD_  (via drill 0.35)
  Top 0.3: v54,36.12 54,45.38 IC4.19
  Bottom 0.3: IC4.19 54,45.5 55.25,46.75 55.25,50.74 56.5,51.99 56.5,53 IC4.1 | 35.25,30.5 37,32.25 46.12,32.25 46.81,31.56 | 46.81,31.56 47.88,30.5 IC1.6 | v54,36.12 53.85,35.97 51.22,35.97 46.81,31.56
37EXWR  (via drill 0.35)
  Top 0.3: v60.34,19.71 64.75,24.12 65.38,24.12 IC11.8 | v50.32,24.92 52,26.61 52,32.5 48,36.5 48,38 IC1.9 | v54.93,19.37 v54.93,14.92 | v60.01,67.31 v61.59,65.72
  Bottom 0.3: v60.34,19.71 60.12,19.5 57,19.5 56.87,19.37 v54.93,19.37 54.93,20.95 53.75,22.13 52.4,22.13 51.97,22.56 51.97,23.27 v50.32,24.92 | IC5.11 40.75,16.5 42.5,14.75 54.76,14.75 v54.93,14.92 | IC1.10 45.5,38.12 47.88,38.12 IC1.9 48,38.12 48.38,38.12 50.44,40.19 55.75,40.19 58.74,43.18 60.01,43.18 61.59,44.77 v61.59,65.72 | IC2.11 v60.01,67.31
37EXWR_OUTPUT_ENABLE_
  Top 0.3: IC2.1 36.53,62.23 35.12,60.83 35.12,49.75 32.25,46.88 32.25,41.3 30.12,39.17 30.12,28.98 29.36,28.22 24.09,28.22 23.81,27.94 23.81,26.04 25.6,24.25 30.12,24.25 33,21.38 33,16.62 IC5.8
A0  (via drill 0.35)
  Top 0.3: v17.75,40.95 17.75,38.12 19.12,36.75 19.38,36.75 J3.12
  Bottom 0.3: v17.75,40.95 17.61,40.82 13.81,40.82 11.5,43.12 U$1.P$25
A0_HV_SLLC  (via drill 0.35)
  Top 0.3: v89.19,18.62 89.51,18.31 93.57,18.31 94.12,18.86 94.12,18.88 94.93,19.68 94.93,25.71 v94.12,26.52 | v82,36.75 84.12,36.75 J2.12
  Bottom 0.3: v89.19,18.62 84.78,18.62 82,21.4 v82,36.75 | v94.12,26.52 94.61,27 94.61,33.97 92.71,35.88 B5.HV1
A0_LV  (via drill 0.35)
  Top 0.3: v106.5,31.62 106.5,19.5 107.5,18.5 108.25,18.5 114.62,12.12 123.12,12.12 U$2.35/A16
  Bottom 0.3: v106.5,31.62 106.5,32.5 102.88,36.12 B5.LV1
A1  (via drill 0.35)
  Top 0.3: v15.88,34.29 v15.88,30.8
  Bottom 0.3: U$1.P$27 11.38,45.62 10.12,44.38 10.12,34.65 10.46,34.32 13.97,34.32 13.97,30.48 15.56,30.48 v15.88,30.8 | J3.10 16,34.16 v15.88,34.29
A1_HV_SLLC  (via drill 0.35)
  Top 0.3: v111.75,66.12 108.36,69.52 93.39,69.52 84.62,60.75 82.54,60.75 82,60.21 82,55.74 78.5,52.24 78.5,39.12 83.25,34.38 84.12,34.38 J2.10 | v117.12,55.85 119.11,53.88 119.11,52.03 119.7,51.44 125.92,51.44 126.24,51.12 126.24,48.02 131,43.26 131,32.82 v132.62,31.2
  Bottom 0.3: v111.75,66.12 113.34,66.12 117.12,62.34 v117.12,55.85 | v132.62,31.2 132.62,18.76 138,13.38 B6.HV4
A1_LV
  Top 0.3: U$2.36/A17 123.25,14.5 126.75,14.5 127.88,13.38 B6.LV4
A2  (via drill 0.35)
  Top 0.3: v64.67,70.67 62.96,72.39 26.39,72.39 26,72 26,63.78 v25.4,63.18 | IC7.13 73.03,53.79 71.35,55.46 71.35,61.38 72.92,62.94 73.52,62.94 74.22,63.64 74.22,65.33 v74.61,65.72
  Bottom 0.3: U$1.P$40 7.5,61 9.48,62.98 25.2,62.98 v25.4,63.18 | v74.61,65.72 73.71,65.72 73.46,65.47 69.88,65.47 v64.67,70.67
A3  (via drill 0.35)
  Top 0.3: v59.04,55.88 65.38,55.88 IC7.3 | v33.5,49.25 32.12,50.62 32.12,57.12 33.12,58.12 33.12,58.88 31.38,60.62 29.11,60.62 v29.11,61.38 | v12.88,61.75 12,62.62 10.56,62.62 9.75,61.82 9.75,58.62 9.88,58.5 v9.88,56
  Bottom 0.3: v59.04,55.88 57.91,54.75 56.12,54.75 55,53.62 55,51.88 51.3,48.17 39.42,48.17 38.34,49.25 v33.5,49.25 | v29.11,61.38 29.05,61.43 13.19,61.43 v12.88,61.75 | U$1.P$34 9.88,55.75 v9.88,56
A5  (via drill 0.35)
  Top 0.3: v8.88,39.33 9.12,39.33 9.12,49.5 9.75,50.12 9.75,54 11.38,55.62 11.38,55.88 U$1.P$35
  Bottom 0.3: IC3.1 33,3.5 33,5.75 30.12,8.62 24.88,8.62 23.39,10.11 10.5,10.11 8.65,11.95 8.65,13.22 7.88,14 7,14 6.25,14.75 6.27,14.77 6.27,25.89 6.97,26.59 7.86,26.59 9.53,28.26 9.53,39.05 9.25,39.33 v8.88,39.33
A6  (via drill 0.35)
  Top 0.3: v3,58.25 7.38,58.25 7.38,58.38 U$1.P$38 | v2.22,13.97 14.72,1.47 33.54,1.47 arc90 IC3.2
  Bottom 0.3: v3,58.25 2.25,57.5 2.25,14 v2.22,13.97
A7  (via drill 0.35)
  Top 0.3: v3,56.3 3.17,56.12 7.38,56.12 7.38,56 U$1.P$36 | IC3.3 38,3.5 36.19,5.31 35.02,5.31 34.61,5.71 26.36,5.71 26.36,5.72 23.59,8.53 20.54,8.53 19.63,7.62 v12.7,7.62 | v3.17,18.1 4.76,16.51 v4.76,14.61
  Bottom 0.3: v4.76,14.61 4.76,12.86 6.62,11.01 7.86,11.01 10.01,8.86 11.46,8.86 v12.7,7.62 | v3.17,18.1 2.75,18.52 2.75,56.05 v3,56.3
A8  (via drill 0.35)
  Top 0.3: v30.67,16.14 31.21,16.14 34.29,13.06 34.29,9.21 34.92,8.57 v39.05,8.57
  Bottom 0.3: v30.67,16.14 30.67,16.49 30.03,17.13 15.88,17.13 13.39,19.61 13.39,19.62 13.13,19.89 13.13,22.96 11.5,24.59 11.5,25.38 U$1.P$11 | IC3.4 40.62,3.5 40.08,4.05 40.08,7.55 v39.05,8.57
A9  (via drill 0.35)
  Top 0.3: v18.25,12.43 18.25,14.97 v18.04,15.18
  Bottom 0.3: v18.25,12.43 23.57,12.43 26.12,9.88 30.62,9.88 33.15,7.35 36.18,7.35 36.62,6.9 36.62,2.75 37.62,1.75 41.5,1.75 43.12,3.38 IC3.5 | U$1.P$17 11.38,33 10.12,33 10.12,19.88 11.03,18.97 11.92,18.97 12.7,18.2 12.7,17.26 15.03,14.94 17.79,14.94 v18.04,15.18
A10  (via drill 0.35)
  Top 0.3: v44.64,5.25 44.34,5.55 37.74,5.55 v37.42,5.87 | v32.7,8.89 31.11,10.48 31.11,13.02 24.95,13.02 23.32,11.38 17.31,11.38 15.68,13.02 13.97,13.02 12.94,14.05 10.94,14.05 9.74,15.24 U$1.P$4
  Bottom 0.3: IC3.6 45.72,4.04 44.64,5.12 v44.64,5.25 | v32.7,8.89 33.2,8.89 34.24,7.85 36.39,7.85 37.42,6.81 v37.42,5.87
A11  (via drill 0.35)
  Top 0.3: v28.05,16.17 v30.12,18.25
  Bottom 0.3: IC6.13 57.73,10.42 51.08,10.42 48,13.5 39,13.5 36.62,15.88 36.62,18.25 v30.12,18.25 | v28.05,16.17 27.59,16.62 15.62,16.62 12.62,19.62 12.62,22.75 11.5,22.75 U$1.P$9
A12
  Bottom 0.3: IC3.11 40.62,11.12 37.32,14.43 14.82,14.43 11.5,17.75 U$1.P$5
A13  (via drill 0.35)
  Top 0.3: U$1.P$6 8.73,16.51 v9.84,16.51
  Bottom 0.3: IC3.12 38.1,12.93 37.1,13.93 14.61,13.93 14.51,14.03 14.35,14.03 11.88,16.5 9.85,16.5 v9.84,16.51
A14  (via drill 0.35)
  Top 0.3: v5.5,21.12 7.12,22.75 7.38,22.75 U$1.P$10 | v41.75,7.39 41.7,7.35 25.49,7.35 23.8,9.03 15.42,9.03 v15.24,9.21 | IC6.2 61.67,1.67 52.7,1.67 48.97,5.4 v48.9,5.4
  Bottom 0.3: v5.5,21.12 5.5,12.88 6.87,11.51 8.38,11.51 10.41,9.48 14.97,9.48 v15.24,9.21 | v41.75,7.39 46.9,7.39 v48.9,5.4
A15  (via drill 0.35)
  Top 0.3: U$1.P$7 11.5,20.25 11.5,20 11.88,19.62 31.18,19.62 v31.43,19.37 | v34.61,19.37 34.61,19.02 35.44,18.18 35.98,18.18 36.57,17.59 36.57,15.94 37.68,14.84 38.79,14.84 v38.88,14.75 | v50.16,13.02 55.69,13.02 56.7,12 59.43,12 63.5,7.94 IC6.3
  Bottom 0.3: v38.88,14.75 39.5,14.12 49.05,14.12 v50.16,13.02 | v31.43,19.37 v34.61,19.37
D0  (via drill 0.35)
  Top 0.3: v49.88,51.38 49.88,49 46.38,45.5 IC4.16 | v45.9,58.23 43.67,58.23 42.25,59.65 42.25,62 IC2.3 40.55,63.9 40.46,63.9 39.62,64.74 v39.62,66.01 | v9.12,58.12 9.12,50.25 8.5,49.62 8.5,49.38 7.5,48.38 U$1.P$30 | v30.26,64.62 35.88,64.62 v35.88,64.75
  Bottom 0.3: v49.88,51.38 49.88,51.88 50,52 50,55.08 46.85,58.23 v45.9,58.23 | v9.12,58.12 9.12,60.33 10.24,61.44 10.24,61.45 11.27,62.48 13.18,62.48 13.72,61.94 27.57,61.94 v30.26,64.62 | v39.62,66.01 37.13,66.01 v35.88,64.75
D0_HV  (via drill 0.35)
  Top 0.3: v44.62,56.75 41.77,56.75 39.75,58.77 39.75,62.12 IC2.2
  Bottom 0.3: J3.25 22,54.5 32,54.5 32,54.79 32.13,54.92 32.13,56.89 34.38,59.14 38.77,59.14 39.69,60.06 IC2.2 | v44.62,56.75 45.25,56.75 48.88,53.12 IC4.4
D0_HV_SLLC
  Bottom 0.3: J2.25 86.75,54.62 86.75,55.88 91.38,60.5 91.38,63.75 92.62,65 B3.HV4
D0_LV  (via drill 0.35)
  Top 0.3: U$2.15/A1 123.12,37.5 120.88,37.5 109.12,49.25 109.12,50.62 108.25,51.5 107.25,51.5 105.41,53.34 v105.41,56.2 | B3.LV4 103.5,65.09 105.41,63.18 v105.41,60.33
  Bottom 0.3: v105.41,60.33 v105.41,56.2
D1  (via drill 0.35)
  Top 0.3: IC4.14 41.38,45.5 41.38,47.12 42.38,48.12 v42.38,55.01 42.38,55.12 41,55.12 v36.25,59.88 | v9.88,45.25 9.75,45.12 9.75,38.96 8.89,38.1 U$1.P$22 | v14.3,54.42 16.5,56.62 v16.5,57.5 | v28.99,58.33 29.16,58.5 v32.38,58.5
  Bottom 0.3: v9.88,45.25 9.88,52.12 12,52.12 v14.3,54.42 | v32.38,58.5 33.75,59.88 v36.25,59.88 | IC2.4 44.77,60.01 42.69,57.93 42.69,55.33 v42.38,55.01 | v16.5,57.5 16.61,57.39 28.06,57.39 v28.99,58.33
D1_HV
  Top 0.3: IC4.6 44.13,53.34 44.13,54.29 47.31,57.47 IC2.5
  Bottom 0.3: J3.23 22,51.88 22.77,51.11 39.26,51.11 40.15,50.22 43.81,50.22 IC4.6
D1_HV_SLLC  (via drill 0.35)
  Top 0.3: v91.25,56.62 91.25,61.12 92.62,62.5 B3.HV3
  Bottom 0.3: v91.25,56.62 86.75,52.12 J2.23
D1_LV  (via drill 0.35)
  Top 0.3: v115.44,59.62 118.43,56.62 120.88,56.62 122.25,55.25 123.12,55.25 U$2.22/A8
  Bottom 0.3: B3.LV3 102.88,62.5 103.62,61.75 110.02,61.75 111.44,60.33 112.71,60.33 113.42,59.62 v115.44,59.62
D2  (via drill 0.35)
  Top 0.3: v55.25,55 55.25,54.25 55.38,54.12 55.38,51.75 51.5,47.88 51.5,45.5 IC4.18 51.38,45.38 51.38,44.75 v47.62,41 | v3.62,54.62 7.38,50.88 U$1.P$32 | v9.79,66.71 14.91,61.59 v14.91,59.38 | v26.08,58.12 26.08,57.17 28,55.25 28,36.77 28.26,36.51 29.53,36.51 29.62,36.61 29.62,40.24 v29.75,40.24
  Bottom 0.3: v55.25,55 55.25,55.63 52.5,58.38 52.5,62.12 IC2.7 | v3.62,54.62 3.72,54.62 3.75,54.65 3.75,66.71 v9.79,66.71 | v47.62,41 46.99,40.37 29.88,40.37 v29.75,40.24 | v14.91,59.38 16.06,59.38 17.54,57.9 25.85,57.9 v26.08,58.12
D2_HV
  Bottom 0.3: IC2.6 49.88,62.12 49.88,59.12 53.88,55.12 53.88,53.12 IC4.2 53.75,53.12 50.34,49.72 39.94,49.72 39.05,50.61 25.02,50.61 23.81,49.4 J3.21
D2_HV_SLLC
  Bottom 0.3: J2.21 86.75,49.62 87.38,49.62 92.62,54.88 B3.HV2
D2_LV
  Bottom 0.3: U$2.23/A9 123.12,57.75 122.25,57.75 120.83,56.34 120.2,56.34 119.56,55.7 119.56,55.06 119.11,54.61 112.03,54.61 111.58,55.06 111.44,55.06 111.38,55.12 109.38,55.12 108.38,54.12 103.62,54.12 102.88,54.88 B3.LV2
D3  (via drill 0.35)
  Top 0.3: v52.63,66.33 53.62,65.34 53.62,63.5 54.88,62.25 IC2.8 | v41.19,65.18 42.15,65.18 42.37,65.41 44.77,65.41 44.95,65.22 v44.95,64.93 | v26.62,48.62 26.62,52.38 v23.75,55.25
  Bottom 0.3: v26.62,48.62 27.14,48.1 33.52,48.1 36.12,45.5 IC4.12 | U$1.P$26 7.5,43.25 8.75,43.25 8.75,52.38 11,54.62 11.88,54.62 13.38,56.12 22.88,56.12 v23.75,55.25 23.75,55.12 31.62,55.12 31.62,58.88 33.37,60.62 33.8,60.62 35.75,62.57 35.75,63 37.38,64.64 40.65,64.64 v41.19,65.18 | v52.63,66.33 48.55,66.33 46.99,64.77 45.11,64.77 v44.95,64.93
D3_HV  (via drill 0.35)
  Top 0.3: v38.75,49.88 38.75,53 IC4.8 | v55.58,57.33 52.5,54.25 52.5,51.88 53,51.38 v53,51.25
  Bottom 0.3: J3.19 22,46.88 25.12,50 38.62,50 v38.75,49.88 39.7,48.92 50.67,48.92 v53,51.25 | IC2.9 57.38,62.12 57.38,59.12 v55.58,57.33
D3_HV_SLLC
  Bottom 0.3: J2.19 86.75,47 87.25,47 92.62,52.38 B3.HV1
D3_LV
  Top 0.3: U$2.9/CS 106.05,40.01 105.41,40.64 105.41,43.61 104.25,44.77 104.27,44.79 104.27,46.68 105.73,48.14 105.73,50.8 104.14,52.39 B3.LV1
D4  (via drill 0.35)
  Top 0.3: v27.22,68.36 27.22,68.24 29.52,65.94 37.44,65.94 39.13,67.63 48.58,67.63 48.83,67.88 48.83,70.93 49.43,71.52 53.25,71.52 IC2.13 | v54.93,67.63 v54.93,65.09
  Bottom 0.3: U$1.P$18 4.94,33.02 4.38,33.59 4.38,60.33 4.5,60.45 4.5,60.53 8.34,64.38 23.5,64.38 27.22,68.09 v27.22,68.36 | IC2.13 v54.93,67.63 | v54.93,65.09 54.7,64.86 50.38,64.86 48.83,63.31 48.83,61.15 49.36,60.62 49.36,58.89 52.7,55.55 52.7,53.34 51.75,53.34 IC4.3
D4_HV  (via drill 0.35)
  Top 0.3: v25.62,41 22.38,44.25 22,44.25 J3.17 | v56,50.19 55.68,50.19 v53.87,48.38
  Bottom 0.3: v25.62,41 27,42.37 43.19,42.37 44.83,44.01 44.83,46.1 45.85,47.12 48.9,47.12 48.9,46.99 | v53.87,48.38 53.23,48.38 51.98,47.12 49.03,47.12 48.9,46.99 | IC4.17 48.9,46.99 | IC2.12 57.47,66.04 58.74,64.77 58.74,59.11 60.4,57.45 60.4,53.42 57.81,50.83 56.63,50.83 v56,50.19
D4_HV_SLLC
  Bottom 0.3: B4.HV4 92.62,32.75 92.62,34.25 88.75,38.12 88.75,43.88 88.25,44.38 86.75,44.38 J2.17
D4_LV
  Top 0.3: B4.LV4 103.19,33.02 103.5,33.02 U$2.10/CS
D5  (via drill 0.35)
  Top 0.3: v36.57,57.33 36.57,53.72 IC4.9 | v26.62,53.75 v24.5,55.88
  Bottom 0.3: v36.57,57.33 36.74,57.15 41.27,57.15 41.37,57.24 41.37,58.03 43.14,59.8 43.14,59.97 43.08,60.02 43.08,60.99 43.24,61.15 43.24,63.67 42.77,64.15 42.77,69.31 IC2.18 | v24.5,55.88 23.62,56.75 12.31,56.75 11.94,57.12 10.88,57.12 10.5,56.75 9.12,56.75 9.12,55.75 8,54.62 6.25,54.62 6.25,47.75 7.38,46.62 7.38,45.75 U$1.P$28 | v26.62,53.75 26.75,53.88 32.38,53.88 33.25,54.75 34.5,54.75 36.12,53.12 IC4.9
D5_HV  (via drill 0.35)
  Top 0.3: v30.88,46.72 v30.88,55.88 | v35.24,66.67 36.83,66.67 v37.15,66.99
  Bottom 0.3: J3.15 22,41.88 26.16,46.04 30.8,46.04 | v30.88,55.88 31,55.88 31,59 33.12,61.12 33.5,61.12 35.24,62.87 35.24,64.35 35.14,64.45 35.14,65.05 35.24,65.15 v35.24,66.67 | IC2.19 39.69,68.26 38.1,66.67 37.47,66.67 v37.15,66.99 | IC4.11 33.02,46.04 30.8,46.04 | v30.88,46.72 30.88,46.12 30.8,46.04
D5_HV_SLLC
  Top 0.3: J2.15 86.75,41.88 86.75,41.25 89.5,38.5 89.5,29.38 89.88,29 91.5,29 92.62,30.12 B4.HV3
D5_LV  (via drill 0.35)
  Top 0.3: v109.54,29.84 111.44,31.75 v112.08,31.75
  Bottom 0.3: U$2.13/SCK 123.12,32.38 112.12,32.38 112.12,31.8 v112.08,31.75 | B4.LV3 102.88,30.12 104.25,28.75 108.5,28.75 109.54,29.79 v109.54,29.84
D6  (via drill 0.35)
  Top 0.3: v31.18,62.33 31.82,62.33 34.38,59.77 v34.38,57.02 | v43.81,60.33 43.18,60.96 43.18,61.09 43.24,61.15 43.24,64.2 v43.5,64.45
  Bottom 0.3: 41.38,55.56 41.38,55.62 35.77,55.62 v34.38,57.02 | 41.38,55.56 41.38,53.12 IC4.7 | v31.18,62.33 29.48,60.62 29.46,60.64 28.8,60.64 28.52,60.93 13.12,60.93 11.94,59.75 10.12,59.75 10.12,58 9.5,57.38 9,57.38 8.75,57.12 5.62,57.12 5.62,42.5 7.38,40.75 U$1.P$24 | 41.38,55.56 41.87,56.06 41.87,57.82 43.81,59.77 v43.81,60.33 | IC2.17 44.13,69.85 43.5,69.22 v43.5,64.45
D6_HV  (via drill 0.35)
  Top 0.3: v29.75,44.62 v29.75,55.88 | v30.8,70.8 v30.8,68.26
  Bottom 0.3: 29.75,43.62 26.38,43.62 J3.13 | 29.75,43.62 36.88,43.62 38.62,45.38 IC4.13 | v29.75,55.88 30.38,56.5 30.38,59.12 33.34,62.09 33.34,63.18 31.75,64.77 31.75,65.41 30.8,66.36 v30.8,68.26 | 29.75,43.62 v29.75,44.62 | IC2.16 47.25,69.88 45.5,71.62 31.62,71.62 v30.8,70.8
D6_HV_SLLC
  Top 0.3: B4.HV2 92.62,22.62 92.62,23.25 88.62,27.25 88.62,37.38 86.75,39.25 J2.13
D6_LV
  Top 0.3: U$2.11/MOSI 107.88,34.88 104.25,31.25 104.25,24 102.88,22.62 B4.LV2
D7  (via drill 0.35)
  Top 0.3: IC4.5 46.36,54.78 48.26,56.67 48.26,61.09 48.32,61.15 48.32,64 v46,66.32 46,66.99 39.56,66.99 36.44,63.88 29.7,63.88 arc-90 v27.23,66.34
  Bottom 0.3: v27.23,66.34 24.64,63.75 8.43,63.75 5,60.33 5,35.96 5.4,35.56 U$1.P$20 | IC2.14 52.39,68.9 51.12,67.63 47.31,67.63 v46,66.32
D7_HV
  Top 0.3: IC2.15 49.88,69.75 49.93,69.69 49.93,69.19 51,68.12 51,61.12 51.12,61 51.12,57.88 47.82,54.57 47.82,50.94 43.88,47 43.88,45.5 IC4.15
  Bottom 0.3: IC4.15 43.81,43.85 42.96,43 26.5,43 23.38,39.88 23.38,36.75 22,36.75 J3.11
D7_HV_SLLC
  Top 0.3: B4.HV1 92.65,20.09 88,24.74 88,35.5 86.75,36.75 J2.11
D7_LV
  Top 0.3: U$2.12/MISO 107.88,32.38 106.12,32.38 104.88,31.12 104.88,22.12 102.88,20.12 B4.LV1
FLIPFLOP_CLR  (via drill 0.35)
  Top 0.3: v44.54,26.5 v42.09,26.5 | v24.77,26.67 v28.26,26.67
  Bottom 0.3: IC5.13 45.75,16.62 45.75,21.74 45.87,21.74 IC5.1 48,24 46.12,25.88 45.49,26.5 v44.54,26.5 | J3.3 24.64,26.54 v24.77,26.67 | v42.09,26.5 41.77,26.82 28.41,26.82 v28.26,26.67
FLIPFLOP_CLR_HV_SLLC  (via drill 0.35)
  Top 0.3: v90.25,29.75 90.25,32.12 93,34.88 103.82,34.88 107.5,38.55 108.4,38.55 110.13,36.83 v110.17,36.83 | B2.HV1 127.88,31 125.31,28.43 115.9,28.43 114.03,30.31 114.03,30.71 113.03,31.7 v113.03,33.97
  Bottom 0.3: v90.25,29.75 87.25,26.75 86.75,26.75 J2.3 | v110.17,36.83 v113.03,33.97
FLIPFLOP_CLR_LV
  Top 0.3: U$2.25 108,24.88 121.75,24.88 123,26.12 125.32,26.12 128.69,29.5 136.5,29.5 138,31 B2.LV1
FLIPFLOP_PRE  (via drill 0.35)
  Top 0.3: v14.5,28.5 14.5,41.88 19.38,46.75 J3.20 | v40.01,19.37 39.05,18.41 v38.1,18.41
  Bottom 0.3: IC5.4 40.75,24.12 40.61,23.98 | v14.5,28.5 13.36,27.36 13.36,24.15 14.13,23.38 14.13,22.06 14.46,21.73 15.17,21.73 15.6,21.3 15.6,20.7 15.56,20.65 15.56,20 16.51,19.05 27.76,19.05 30.19,21.48 38.11,21.48 40.61,23.98 | 38.1,17.24 IC5.10 v38.1,18.41 | 40.61,23.98 40.61,19.75 40.23,19.37 v40.01,19.37
FLIPFLOP_PRE_HV  (via drill 0.35)
  Top 0.3: v79.25,44.12 81.38,44.12 84.12,46.88 J2.20 | v80.01,18.1 80.01,17.7 90.19,7.51 90.19,3.81 90.83,3.17 B1.HV1
  Bottom 0.3: v79.25,44.12 79.38,44 79.38,36 79.5,35.88 79.5,19.32 80.01,18.8 v80.01,18.1
FLIPFLOP_PRE_LV
  Bottom 0.3: U$2.29 107.88,14.5 107.88,13.62 104.25,10 104.25,4.62 102.88,3.25 B1.LV1
GND
  pour Top: 0,73.98 0.31,-0.32 142.24,0.56 142.24,73.1
INTERUPT_TO_TRS80_
  Bottom 0.3: J3.14 19.38,39.25 15.88,39.25 R7.2 15.75,39.25 12.62,39.25 11.5,38.12 U$1.P$21
INTERUPT_TO_TRS80_HV_SLLC_  (via drill 0.35)
  Top 0.3: v95.83,22.72 95.83,18.14 v95.97,18 | v86.68,20.64 v89.22,20.64
  Bottom 0.3: v95.83,22.72 95.83,35.56 92.74,38.64 B5.HV2 | v95.97,18 91.89,18 89.26,20.64 v89.22,20.64 | J2.14 84.12,39.25 82.75,37.88 82.75,22.04 84.15,20.64 v86.68,20.64
INTERUPT_TO_TRS80_LV_
  Bottom 0.3: U$2.8 107.88,42.5 106.62,42.5 102.88,38.75 B5.LV2
N$1
  Bottom 0.3: U$2.AREF 120.75,57.88 123.12,60.25 U$2.3V3_LO
N$2
  Top 0.3: R2.2 129.25,8.25 129.25,5.5 RGB_LED1.2
N$3
  Top 0.3: R6.1 122.75,67.88 118.99,67.88 112.71,61.59 112.71,58.42 112.08,57.78 U$2.2
N$4  (via drill 0.35)
  Top 0.3: v109.38,60 119.12,69.75 122.75,69.75 R5.1
  Bottom 0.3: v109.38,60 109.38,56.62 108,55.25 U$2.3/CANTX
N$5
  Top 0.3: R4.1 122.75,71.75 118.5,71.75 113.35,66.6 113.35,65.41 112.26,64.31 107.18,64.31 106.68,63.82 106.68,62.23 106.36,61.91 106.36,57.15 106.75,56.76 106.75,53.88 107.88,52.75 U$2.4/CANRX
N$6  (via drill 0.35)
  Top 0.3: v117.75,30.99 117.75,36.88 108.12,46.5 107.5,46.5 106.75,47.25 106.75,49 107.88,50.12 U$2.5 | v114.94,8.57 v118.11,5.4
  Bottom 0.3: v117.75,30.99 117.62,31.11 115.99,31.11 114.38,29.5 114.38,9.17 114.94,8.61 v114.94,8.57 | R3.1 126.25,5.12 118.38,5.12 v118.11,5.4
N$7  (via drill 0.35)
  Top 0.3: v119.82,30.99 119.82,36.71 108.9,47.62 U$2.6 | v119.7,17.46 v119.7,13.65
  Bottom 0.3: R2.1 126.62,8.38 120.21,8.38 119.7,8.89 v119.7,13.65 | v119.82,30.99 118.43,29.6 118.43,26.99 119.7,25.72 119.7,20.27 119.56,20.14 119.56,19.23 119.7,19.1 v119.7,17.46
N$8  (via drill 0.35)
  Top 0.3: R1.1 128.62,10.25 128.62,12.12 129.88,13.38 129.88,27.11 v129.51,27.49
  Bottom 0.3: U$2.7 108,45 119.25,33.75 119.25,33.64 120.02,32.88 122.14,32.88 122.74,33.48 123.64,33.48 124.28,32.84 124.28,32.72 v129.51,27.49
N$10
  Top 0.3: R1.2 131.12,10.12 131.12,7 RGB_LED1.1
N$15
  Top 0.3: R3.2 126.38,2.62 129.12,2.62 RGB_LED1.4
N$19
  Top 0.3: R4.2 125.5,71.75 131.12,71.75 RGB_LED2.1
N$20
  Top 0.3: R5.2 125.5,69.88 128.88,69.88 129.12,70.12 RGB_LED2.2
N$21
  Top 0.3: R6.2 125.5,67.88 128.62,67.88 129.12,67.38 RGB_LED2.4
NOTHING1_HV_SLLC  (via drill 0.35)
  Top 0.3: v78.75,34.62 84.12,29.25 J2.6 | v120.48,61.08 122.68,58.88 123.75,58.88 131.62,51 131.62,34.59 v134.69,31.52 | v82.87,64.45 v86.04,64.45
  Bottom 0.3: v78.75,34.62 78.75,43.5 78.5,43.75 78.5,62.02 80.93,64.45 v82.87,64.45 | v120.48,61.08 113.36,68.2 92.68,68.2 88.9,64.42 86.07,64.42 v86.04,64.45 | v134.69,31.52 135.96,30.25 135.96,25.54 138,23.5 B6.HV2
NOTHING1_LV
  Bottom 0.3: U$2.38/A19 123.25,19.75 124.25,19.75 127.88,23.38 B6.LV2
NOTHING2_HV_SLLC
  Top 0.3: J2.4 84.12,26.62 84.12,26 82.75,24.62 82.75,21.72 87.22,17.25 93.25,17.25 101.5,9 101.5,2.62 102.25,1.88 124.25,1.88 126.38,4 129.5,4 131.12,5.62 131.62,5.62 133,7 133,21 138,26 B6.HV1
NOTHING2_LV
  Bottom 0.3: U$2.39/A20 123.83,22.23 127.64,26.04 B6.LV1
NOTHING3_HV_SLLC  (via drill 0.35)
  Top 0.3: J2.8 82.75,31.75 79.12,35.38 78.38,35.38 78,35 78,34.08 78.74,33.34 78.74,17.69 85.73,10.71 v85.73,10.49 | v125.16,6.68 125.16,6.37 123.25,4.45 v123.25,2.87 | v133.75,11.25 133.75,11.62 138,15.88 B6.HV3
  Bottom 0.3: v123.25,2.87 122.26,1.88 92.12,1.88 90.19,3.81 90.19,6.46 88.13,8.53 87.69,8.53 v85.73,10.49 | v125.16,6.68 129.18,6.68 v133.75,11.25
NOTHING3_LV
  Top 0.3: U$2.37/A18 123.25,17.12 126.62,17.12 127.88,15.88 B6.LV3
RAS_  (via drill 0.35)
  Top 0.3: v35.88,6.62 35.89,6.6 49.92,6.6 v50.16,6.35
  Bottom 0.3: v35.88,6.62 35.81,6.55 33.2,6.55 30.5,9.25 25.25,9.25 23.77,10.73 13.39,10.73 11.5,12.62 U$1.P$1 | IC6.1 65.38,2.88 64.12,4.12 52.41,4.12 50.18,6.35 v50.16,6.35
RD  (via drill 0.35)
  Top 0.3: v50.16,41.59 48.35,39.77 44.54,39.77 IC1.11 | v63.5,54.75 58.38,49.62 v58.38,44.55
  Bottom 0.3: v63.5,54.75 63.5,60.88 65.38,60.88 IC7.1 | v50.16,41.59 50.48,41.91 55.88,41.91 58.38,44.41 v58.38,44.55
RD_  (via drill 0.35)
  Top 0.3: v29.92,25.43 29.92,26.7 33.75,30.53 33.75,32.5 37.75,36.5 37.75,38 IC1.13
  Bottom 0.3: IC1.13 37.88,38.12 40.25,38.12 IC1.12 | U$1.P$15 11.5,30.38 12.62,29.25 14.88,29.25 14.88,29.16 15.23,28.8 15.23,28.2 13.86,26.83 13.86,24.36 14.64,23.58 14.64,22.51 14.91,22.23 15.38,22.23 16.19,21.42 16.19,20.32 16.83,19.68 26.58,19.68 26.58,23.75 28.26,25.43 v29.92,25.43
VCC
  pour Bottom: 0,73.66 142.03,73.66 142.35,0 0,0
VCC/2  (via drill 0.35)
  Top 0.3: B6.LV 127.88,20.88 114.25,20.88 113.12,19.75 U$2.3V3_2 | v130.49,31.11 131.44,30.16 136.21,30.16 136.53,30.48 136.53,32.07 135.57,33.02 135.57,35.24 136.53,36.2 B2.LV
  Bottom 0.3: U$2.3V3_2 113,19.75 112,19.75 108.12,23.62 104.25,23.62 102.88,25 B4.LV | B4.LV 102.7,25.08 100.65,23.03 100.65,10.48 B1.LV | B6.LV 131.16,23.99 131.16,29.28 130.49,29.94 v130.49,31.11 | B3.LV 102.75,57.38 102.75,56.75 101.25,55.25 101.25,42.88 102.75,41.38 B5.LV 102.75,41.25 101.31,41.25 101.28,41.27 100.97,40.96 100.97,25.4 101.28,25.08 B4.LV
WAIT_  (via drill 0.35)
  Top 0.3: v30.2,22.5 30.2,22.18 28.26,20.25 14.12,20.25 12.7,21.68 12.7,28.26 12.73,28.26 13.88,29.4 13.88,50.62 11.5,53 11.5,53.25 U$1.P$33
  Bottom 0.3: v30.2,22.5 30.32,22.38 33.75,22.38 35.5,24.12 IC5.6
WR_  (via drill 0.35)
  Top 0.3: 52.88,46.99 52.88,26.12 48.5,21.75 37.54,21.75 v37.54,20.25 | 52.88,46.99 52.88,47 | 52.88,46.99 arc-90 53.38,47.5 53.98,47.5 arc90 57.68,51.21 57.68,56.41 arc-90 60.33,59.05 60.55,59.05 arc90 v63.5,62
  Bottom 0.3: v63.5,62 66.5,62 69.25,59.25 72.25,59.25 73,58.5 IC7.15 | U$1.P$13 11.5,27.88 12.62,27.88 12.62,25.62 12.7,25.55 12.7,24.1 13.63,23.17 13.63,20.66 13.65,20.64 13.65,20.08 15.95,17.78 27.91,17.78 30.55,20.42 37.37,20.42 v37.54,20.25
XX11X111111XXXX
  Bottom 0.3: IC3.8 48.38,11 51.38,8 57.75,8 IC6.14

### Text on the board
tNames: TRS-80 / SS Drive / V4.1